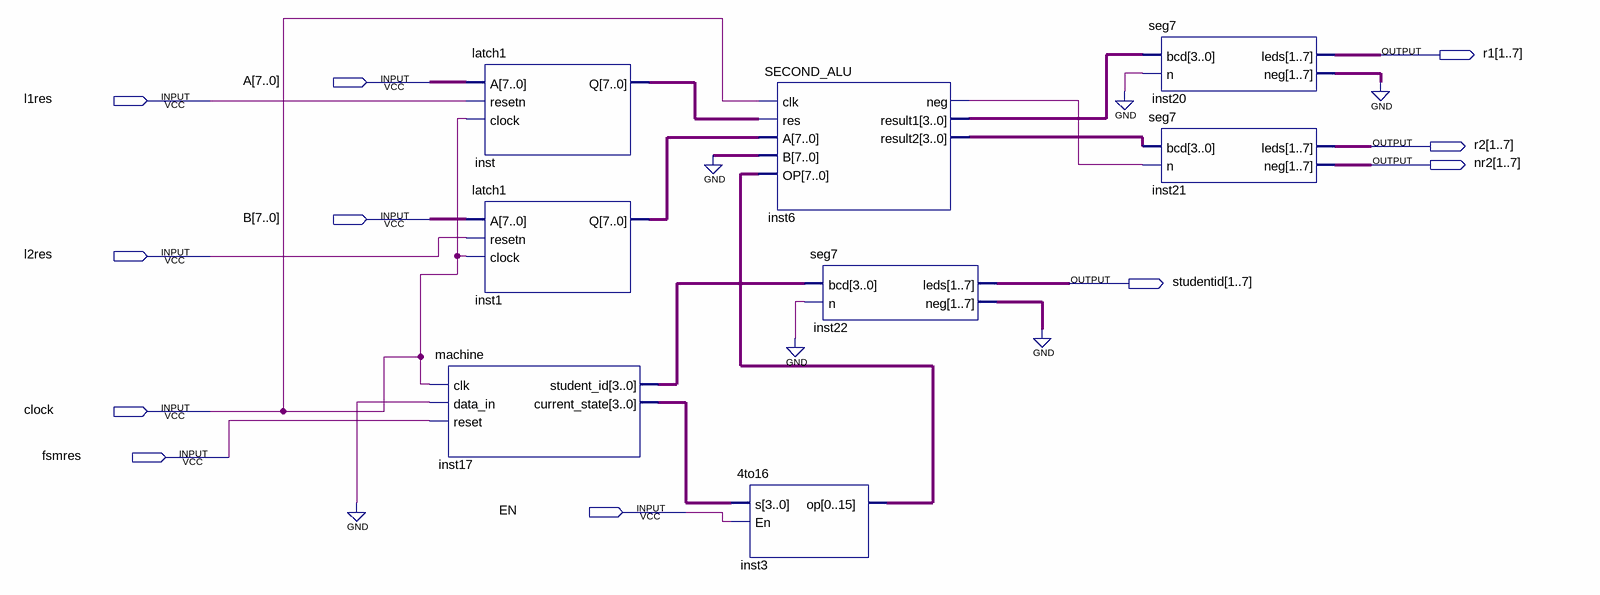
[diagram p0: schematic sheet]
// Quartus schematic gpu.bdf as structural Verilog: 8 symbols, 11 pins
module gpu (
  input  [7:0] A,
  input  l1res,
  input  [7:0] B,
  input  l2res,
  input  clock,
  input  fsmres,
  input  EN,
  output [1:7] r1,
  output [1:7] r2,
  output [1:7] nr2,
  output [1:7] studentid
);

  wire inst6_neg;
  wire [3:0] inst6_result1, inst6_result2, inst17_current_state, inst17_student_id;
  wire [6:0] inst20_neg, inst22_neg;
  wire [7:0] inst1_q, inst_q;
  wire [15:0] inst3_op;

  machine inst17 (
    .clk(clock), .data_in(1'b0), .reset(fsmres), .student_id(inst17_student_id),
    .current_state(inst17_current_state));
  latch1 inst (.A(A), .resetn(l1res), .clock(clock), .Q(inst_q));
  latch1 inst1 (.A(B), .resetn(l2res), .clock(clock), .Q(inst1_q));
  \4to16  inst3 (.s(inst17_current_state), .En(EN), .op(inst3_op));
  SECOND_ALU inst6 (
    .clk(clock), .res(inst_q), .A(inst1_q), .B({8{1'b0}}), .OP(inst3_op), .neg(inst6_neg),
    .result1(inst6_result1), .result2(inst6_result2));
  seg7 inst22 (.bcd(inst17_student_id), .n(1'b0), .leds(studentid), .neg(inst22_neg));
  seg7 inst20 (.bcd(inst6_result1), .n(1'b0), .leds(r1), .neg(inst20_neg));
  seg7 inst21 (.bcd(inst6_result2), .n(inst6_neg), .leds(r2), .neg(nr2));
  // also tied to GND on the sheet: {inst20_neg[0], inst20_neg[1], inst20_neg[2], inst20_neg[3], inst20_neg[4], inst20_neg[5], inst20_neg[6], inst22_neg[0], inst22_neg[1], inst22_neg[2], inst22_neg[3], inst22_neg[4], inst22_neg[5], inst22_neg[6]}
endmodule
